# Altium schematic sheet USB.SchDoc: USB
size A4; Author: -; CompanyName: IOElectro; DrawnBy: Esmaeill M; Engineer: -; Organization: IOElectro; Address1: Bushehr,Iran; Address2: www.ioelectro.ir; DocumentNumber: 3; Revision: v0.1; SheetNumber: 3; SheetTotal: 4; ProjectNumber: 1013; Note: USB
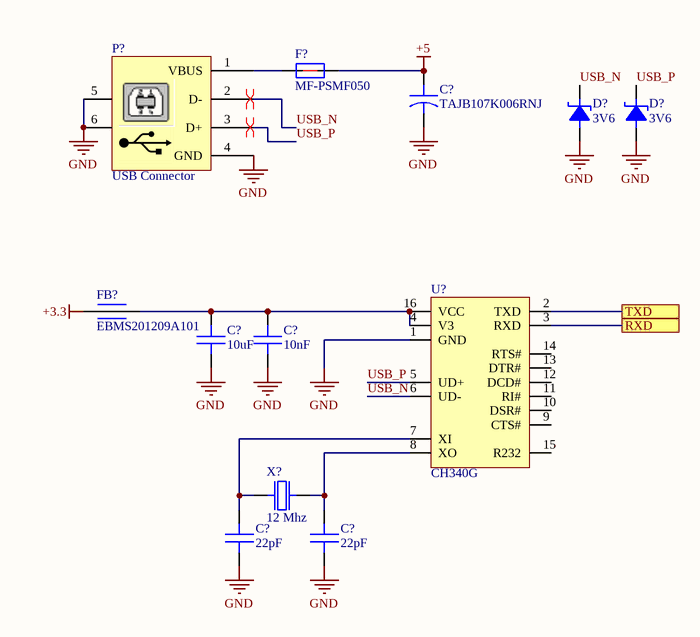
[diagram p0: USB.SchDoc]

## Parts
(Parts that share a designator on the sheet are numbered #1, #2 ... from top to bottom, then left to right.)
C?#1  TAJB107K006RNJ  [TAJB]
C?#2  10uF  [C-0805]
C?#3  10nF  [C-0805]
C?#4  22pF  [C-0805]
C?#5  22pF  [C-0805]
D?#1  3V6  [SOD80]
D?#2  3V6  [SOD80]
F?  MF-PSMF050  [MF-PSMF]
FB?  EBMS201209A101  [R-0805]
P?  USB Connector  [USB2.5-2H4E]
U?  CH340G  [SOP-16]
X?  12 Mhz  [XTAL-DIP_Small]

## Ports
RXD, TXD

## Nets
+3.3: FB?.1
+5: C?#1.A F?.2
GND: C?#1.K C?#2.2 C?#3.2 C?#4.2 C?#5.2 D?#1.A D?#2.A P?.4(GND) P?.5 P?.6 U?.1(GND)
RXD: U?.3(RXD) ; port RXD
TXD: U?.2(TXD) ; port TXD
USB_N: D?#1.K P?.2(D-) U?.6(UD-)
USB_P: D?#2.K P?.3(D+) U?.5(UD+)
NetC?#2_1: C?#2.1 C?#3.1 FB?.2 U?.4(V3) U?.16(VCC)
NetC?#4_1: C?#4.1 U?.7(XI) X?.2
NetC?#5_1: C?#5.1 U?.8(XO) X?.1
NetF?_1: F?.1 P?.1(VBUS)

Not connected (* = marked no-connect by the designer): U? 9(CTS#) 10(DSR#) 11(RI#) 12(DCD#) 13(DTR#) 14(RTS#) 15(R232)

## Layout directives
differential pair: USB_N, USB_P

## Notes on the sheet
- Title
- Size:
- Date:
- A4
- Project Number:
- Time:
- Revision:
- Sheet
- of
- Drawn By:
- IOElectro
- File:
- Note:

## Library data of the parts
C?#1 = TAJB107K006RNJ: AVX - TAJB107K006RNJ - Surface Mount Tantalum Capacitor, 100 µF, 6.3 V, 1411 [3528 Metric], TAJ Series, ± 10%, -55 °C; Manufacturer: Kyocera AVX; Capacitance: 100uF; ESR (Equivalent Series Resistance): 1.7R; Voltage Rating (DC): 6.3V; Leakage Current: 6.3uA; Polarity: Polar; Supplier 1: Digi-Key; Manufacturer Part Number: TAJB107K006RNJ; RoHS: Yes; Category: Tantalum Capacitors; Stock 1: 10000; Pricing 1: 1=0/71000, 10=0/52500, 50=0/41980, 100=0/35980, 500=0/28486, 1000=0/23989 (USD); Mount: Surface Mount,PCB; Case/Package: 1210; Dielectric Material: Tantalum; Case Code (Imperial): 1210; Case Code (Metric): 3528; Min Operating Temperature: -55°C; Max Operating Temperature: 125°C; Tolerance: 10%; Packaging: Tape and Reel; Voltage: 6.3V; Voltage Rating: 6.3V; Package Quantity: 1; Termination: SMD/SMT; Dissipation Factor: 10%; Features: General Purpose; Series: TAJ; Construction: Flat; Length: 3.5mm; Width: 2.8mm; Height: 1.9mm; Depth: 2.8mm; Height - Seated (Max): 0.083inch; Radiation Hardening: No; REACH SVHC: No SVHC; Lead Free: Lead Free; RoHS Compliant: Yes; ComponentLink1URL: https://datasheet.ciiva.com/11794/0900766b802e69d0-11794415.pdf?src-supplier=RSComponents; ComponentLink1Description: https://datasheet.ciiva.com/11794/0900766b802e69d0-11794415.pdf?src-supplier=RSComponents; ComponentLink2URL: https://datasheet.ciiva.com/26915/getdatasheetpartid-133381-26915174.pdf?src-supplier=Verical; ComponentLink2Description: https://datasheet.ciiva.com/26915/getdatasheetpartid-133381-26915174.pdf?src-supplier=Verical; ComponentLink3URL: https://datasheet.ciiva.com/18710/taj-eng-18710634.pdf?src-supplier=Distrelec; ComponentLink3Description: https://datasheet.ciiva.com/18710/taj-eng-18710634.pdf?src-supplier=Distrelec; ComponentLink4URL: https://datasheet.ciiva.com/7720/1680476-7720606.pdf?src-supplier=Element14; ComponentLink4Description: https://datasheet.ciiva.com/7720/1680476-7720606.pdf?src-supplier=Element14; ComponentLink5URL: https://datasheet.ciiva.com/7720/1680476-7720607.pdf?src-supplier=Element14; ComponentLink5Description: https://datasheet.ciiva.com/7720/1680476-7720607.pdf?src-supplier=Element14; ComponentLink6URL: https://datasheet.ciiva.com/264/taj-264188.pdf?src-supplier=Digi-Key; ComponentLink6Description: https://datasheet.ciiva.com/264/taj-264188.pdf?src-supplier=Digi-Key; ComponentLink7URL: https://datasheet.ciiva.com/264/taj-264187.pdf?src-supplier=Digi-Key; ComponentLink7Description: https://datasheet.ciiva.com/264/taj-264187.pdf?src-supplier=Digi-Key; ComponentLink8URL: https://datasheet.ciiva.com/264/taj-264189.pdf?src-supplier=Digi-Key; ComponentLink8Description: https://datasheet.ciiva.com/264/taj-264189.pdf?src-supplier=Digi-Key; ComponentLink9URL: https://datasheet.ciiva.com/14602/70001050-14602126.pdf?src-supplier=Allied+Electronics; ComponentLink9Description: https://datasheet.ciiva.com/14602/70001050-14602126.pdf?src-supplier=Allied+Electronics; ComponentLink10URL: https://datasheet.ciiva.com/14599/70001050-14599717.pdf?src-supplier=Allied+Electronics; ComponentLink10Description: https://datasheet.ciiva.com/14599/70001050-14599717.pdf?src-supplier=Allied+Electronics; ComponentLink11URL: https://datasheet.ciiva.com/11224/taj-11224955.pdf?src-supplier=Avnet; ComponentLink11Description: https://datasheet.ciiva.com/11224/taj-11224955.pdf?src-supplier=Avnet; ComponentLink12URL: https://datasheet.ciiva.com/16632/taj-16632597.pdf?src-supplier=Avnet+Europe; ComponentLink12Description: https://datasheet.ciiva.com/16632/taj-16632597.pdf?src-supplier=Avnet+Europe; Supplier Part Number 1: 478-1677-1-ND
C?#2-C?#5 = CAP: SMD 0805
D?#1 D?#2 = DIODE-Z: SMD MiniMELF
F? = MF-PSMF050X-2: BOURNS   MF-PSMF050X-2   FUSE, RESETTABLE PTC, 6V, 500MA, 0805; Number of Terminals/Pins: 2; Max Current Rating: 40A; Power Dissipation: 500mW; Trip Current: 1A; Resistance: 900mR; Time to Trip: 0.1s; Approvals: UL; Supplier 1: Digi-Key; Manufacturer: Bourns; Manufacturer Part Number: MF-PSMF050X-2; RoHS: Yes; Category: PTC Resettable Fuses; Stock 1: 9973; Pricing 1: 1=0/80000, 5=0/78000, 10=0/75600, 50=0/63600, 100=0/52800, 250=0/48000, 500=0/40800, 1000=0/36000 (USD); Mount: Surface Mount,PCB; Case/Package: 0805; Number of Pins: 2; Case Code (Metric): 2012; Case Code (Imperial): 0805; Terminal Material: Gold; Min Operating Temperature: -40°C; Max Operating Temperature: 85°C; Hold Current: 500mA; Packaging: Tape and Reel; Operating Supply Voltage: 6V; Voltage Rating: 6V; Package Quantity: 3000; Current Rating: 40A; Termination: SMD/SMT; Max Power Dissipation: 500mW; Voltage Rating (DC): 6V; Series: MF-PSMF; Length: 2.3mm; Width: 1.5mm; Height: 0.85mm; Radiation Hardening: No; REACH SVHC: No SVHC; RoHS Compliant: Yes; ComponentLink1URL: https://datasheet.ciiva.com/3019/mfpsmf-3019798.pdf?src-supplier=Avnet; ComponentLink1Description: https://datasheet.ciiva.com/3019/mfpsmf-3019798.pdf?src-supplier=Avnet; ComponentLink2URL: https://datasheet.ciiva.com/3019/mfpsmf-3019799.pdf?src-supplier=Avnet; ComponentLink2Description: https://datasheet.ciiva.com/3019/mfpsmf-3019799.pdf?src-supplier=Avnet; ComponentLink3URL: https://datasheet.ciiva.com/22657/1442129-22657847.pdf?src-supplier=Element14; ComponentLink3Description: https://datasheet.ciiva.com/22657/1442129-22657847.pdf?src-supplier=Element14; ComponentLink4URL: https://datasheet.ciiva.com/26946/getdatasheetpartid-137409-26946007.pdf?src-supplier=Verical; ComponentLink4Description: https://datasheet.ciiva.com/26946/getdatasheetpartid-137409-26946007.pdf?src-supplier=Verical; ComponentLink5URL: https://datasheet.ciiva.com/326/mfpsmf-326488.pdf?src-supplier=Digi-Key; ComponentLink5Description: https://datasheet.ciiva.com/326/mfpsmf-326488.pdf?src-supplier=Digi-Key; ComponentLink6URL: https://datasheet.ciiva.com/326/mfpsmf-326489.pdf?src-supplier=Digi-Key; ComponentLink6Description: https://datasheet.ciiva.com/326/mfpsmf-326489.pdf?src-supplier=Digi-Key; ComponentLink7URL: https://datasheet.ciiva.com/326/mfpsmf-326490.pdf?src-supplier=Digi-Key; ComponentLink7Description: https://datasheet.ciiva.com/326/mfpsmf-326490.pdf?src-supplier=Digi-Key; ComponentLink8URL: https://datasheet.ciiva.com/4501/mfpsmf-69505-4501179.pdf?src-supplier=Mouser; ComponentLink8Description: https://datasheet.ciiva.com/4501/mfpsmf-69505-4501179.pdf?src-supplier=Mouser; ComponentLink9URL: https://datasheet.ciiva.com/32430/mf-psmf-series-eng-tds-32430651.pdf?src-supplier=Distrelec; ComponentLink9Description: https://datasheet.ciiva.com/32430/mf-psmf-series-eng-tds-32430651.pdf?src-supplier=Distrelec; ComponentLink10URL: https://datasheet.ciiva.com/1274/1442129-1274589.pdf?src-supplier=Element14; ComponentLink10Description: https://datasheet.ciiva.com/1274/1442129-1274589.pdf?src-supplier=Element14; ComponentLink11URL: https://datasheet.ciiva.com/17401/mfpsmf-17401741.pdf?src-supplier=Avnet+Europe; ComponentLink11Description: https://datasheet.ciiva.com/17401/mfpsmf-17401741.pdf?src-supplier=Avnet+Europe; ComponentLink12URL: https://datasheet.ciiva.com/22712/1442129-22712191.pdf?src-supplier=Element14; ComponentLink12Description: https://datasheet.ciiva.com/22712/1442129-22712191.pdf?src-supplier=Element14; Supplier Part Number 1: MF-PSMF050X-2CT-ND
FB? = EBMS201209A101: FERRITE BEAD 0805 100R 100Mhz
P? = USB-B: USB Connector-B Type; Designer: Eng. Saeid Jorablo; Company: DASE Co; Adding Date: 10/26/2010
U? = CH340G: IC USB to Serial; Case/Package: MSOP-10
X? = XTAL: Crystal oscillator